# EAGLE design INSIDER (EAGLE 7.2.0)
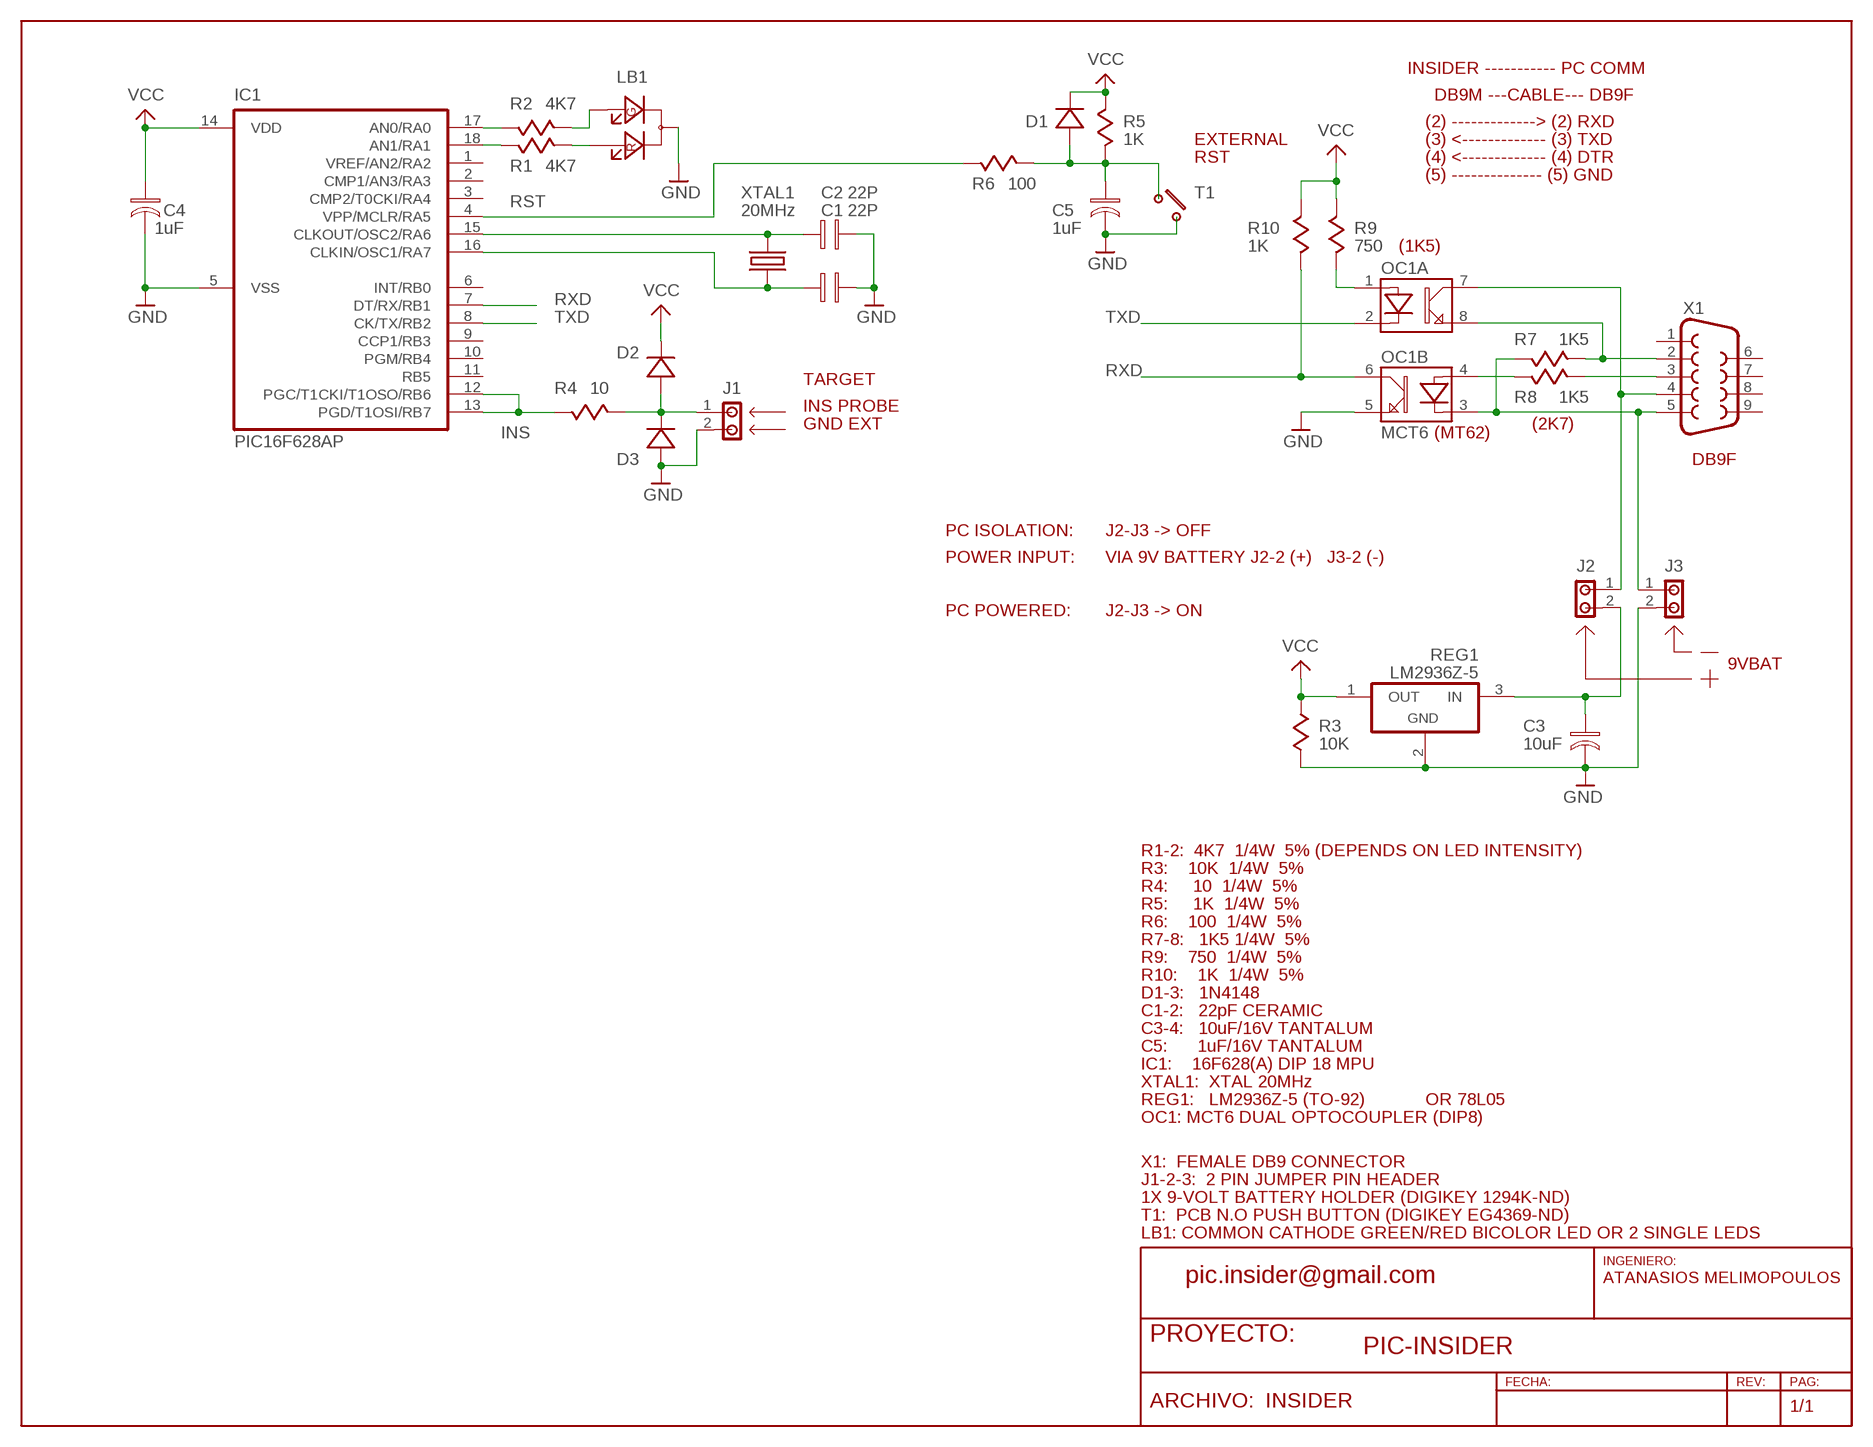
[diagram p0: schematic, sheet 1]

## Parts
C1  22P  CAP02  [C02]
C2  22P  CAP02  [C02]
C3  10uF  CAPE01  [CP01]
C4  1uF  CAPE01  [CP01]
C5  1uF  CAPE01  [CP01]
D1  1N4148  DIODE03  [D03]
D2  1N4148  DIODE03  [D03]
D3  1N4148  DIODE03  [D03]
IC1  PIC16F628AP  [DIL18]
J1  JMP2  [JP2]
J2  JMP2  [JP2]
J3  JMP2  [JP2]
LB1  LEDBIKC  [LEDBKC]
OC1  MCT6  OPTO2G  [DIL08]
R1  4K7  RES03  [R03]
R2  4K7  RES03  [R03]
R3  10K  RES03  [R03]
R4  10  RES03  [R03]
R5  1K  RES03  [R03]
R6  100  RES03  [R03]
R7  1K5  RES03  [R03]
R8  1K5  RES03  [R03]
R9  750  RES03  [R03]
R10  1K  RES03  [R03]
REG1  LM2936Z-5  78XXL  [TO92A]
T1  TEC3  [TEC3L]
X1  F09D  [F09D]
XTAL1  20MHz  XTALV300  [HC49V]

## Nets
GND: C1.P$2 C2.P$2 C3.P$2 C4.P$2 C5.P$2 D3.P$1(A) IC1.5(VSS) J1.2 J3.2 LB1.K OC1.5(B:E) R3.P$2 REG1.2(GND) T1.4
INS: IC1.12(PGC/T1CKI/T1OSO/RB6) IC1.13(PGD/T1OSI/RB7) R4.P$1
N$1: J3.1 OC1.3(B:K) R7.P$2 X1.5
N$2: OC1.8(A:E) R7.P$1 X1.2
N$3: J2.1 OC1.7(A:C) X1.4
N$4: R8.P$1 X1.3
N$5: OC1.4(B:A) R8.P$2
N$6: OC1.1(A:A) R9.P$1
N$9: D2.P$1(A) D3.P$2(K) J1.1 R4.P$2
N$10: C2.P$1 IC1.15(CLKOUT/OSC2/RA6) XTAL1.1
N$11: C1.P$1 IC1.16(CLKIN/OSC1/RA7) XTAL1.2
N$12: IC1.17(AN0/RA0) R2.P$2
N$13: LB1.R(A1) R1.P$1
N$14: LB1.G(A2) R2.P$1
N$16: IC1.18(AN1/RA1) R1.P$2
N$19: C5.P$1 D1.P$1(A) R5.P$2 R6.P$2 T1.1
N$20: C3.P$1 J2.2 REG1.3(IN)
RST: IC1.4(VPP/MCLR/RA5) R6.P$1
RXD: IC1.7(DT/RX/RB1) OC1.6(B:C) R10.P$1
TXD: IC1.8(CK/TX/RB2) OC1.2(A:K)
VCC: C4.P$1 D1.P$2(K) D2.P$2(K) IC1.14(VDD) R3.P$1 R5.P$1 R9.P$2 R10.P$2 REG1.1(OUT)
Unconnected: IC1.1(VREF/AN2/RA2) IC1.2(CMP1/AN3/RA3) IC1.3(CMP2/T0CKI/RA4) IC1.6(INT/RB0) IC1.9(CCP1/RB3) IC1.10(PGM/RB4) IC1.11(RB5) X1.1 X1.6 X1.7 X1.8 X1.9

## Notes on the sheet
- INSIDER ----------- PC COMM
- DB9M ---CABLE--- DB9F
- (2) -------------> (2) RXD
- EXTERNAL | (3) <------------- (3) TXD
- RST | (4) <------------- (4) DTR
- (5) -------------- (5) GND
- (1K5)
- TARGET
- INS PROBE
- GND EXT | (2K7)
- (MT62)
- DB9F
- PC ISOLATION: | J2-J3 -> OFF
- POWER INPUT: | VIA 9V BATTERY J2-2 (+)   J3-2 (-)
- PC POWERED: | J2-J3 -> ON
- 9VBAT
- R1-2:  4K7  1/4W  5% (DEPENDS ON LED INTENSITY)
- R3:    10K  1/4W  5%
- R4:     10  1/4W  5%
- R5:     1K  1/4W  5%
- R6:    100  1/4W  5%
- R7-8:   1K5 1/4W  5%
- R9:    750  1/4W  5%
- R10:    1K  1/4W  5%
- D1-3:   1N4148
- C1-2:   22pF CERAMIC
- C3-4:   10uF/16V TANTALUM
- C5:      1uF/16V TANTALUM
- IC1:    16F628(A) DIP 18 MPU
- XTAL1:  XTAL 20MHz
- REG1:   LM2936Z-5 (TO-92) | OR 78L05
- OC1: MCT6 DUAL OPTOCOUPLER (DIP8)
- X1:  FEMALE DB9 CONNECTOR
- J1-2-3:  2 PIN JUMPER PIN HEADER
- 1X 9-VOLT BATTERY HOLDER (DIGIKEY 1294K-ND)
- T1:  PCB N.O PUSH BUTTON (DIGIKEY EG4369-ND)
- LB1: COMMON CATHODE GREEN/RED BICOLOR LED OR 2 SINGLE LEDS
- pic.insider@gmail.com | ATANASIOS MELIMOPOULOS
- PIC-INSIDER

## Library data of the parts
C1 C2 = AtaLib:CAP: Capacitor
C3-C5 = AtaLib:CAPE: Capacitor Pol. Elect.
D1-D3 = AtaLib:DIODE: DIODES
IC1 = AtaLib:PIC16F6*: PIC 16F627 - 628 - 648 family
J1-J3 = AtaLib:JMP2: Jumper 2xPin
LB1 = AtaLib:LEDBIKC: LED BIcolor KC 5mm
OC1 = AtaLib:OPTO2G: OPTOCOUPLER dual unit
R1-R10 = AtaLib:RES: Resistor
REG1 = AtaLib:78XX: Positive Voltage Regulator
T1 = AtaLib:TEC: TECLAS INDIVIDUALES
X1 = AtaLib:F09: D-SUB 9 FEMALE
XTAL1 = AtaLib:XTALV300: Xtal Vert 300 mils

## Board
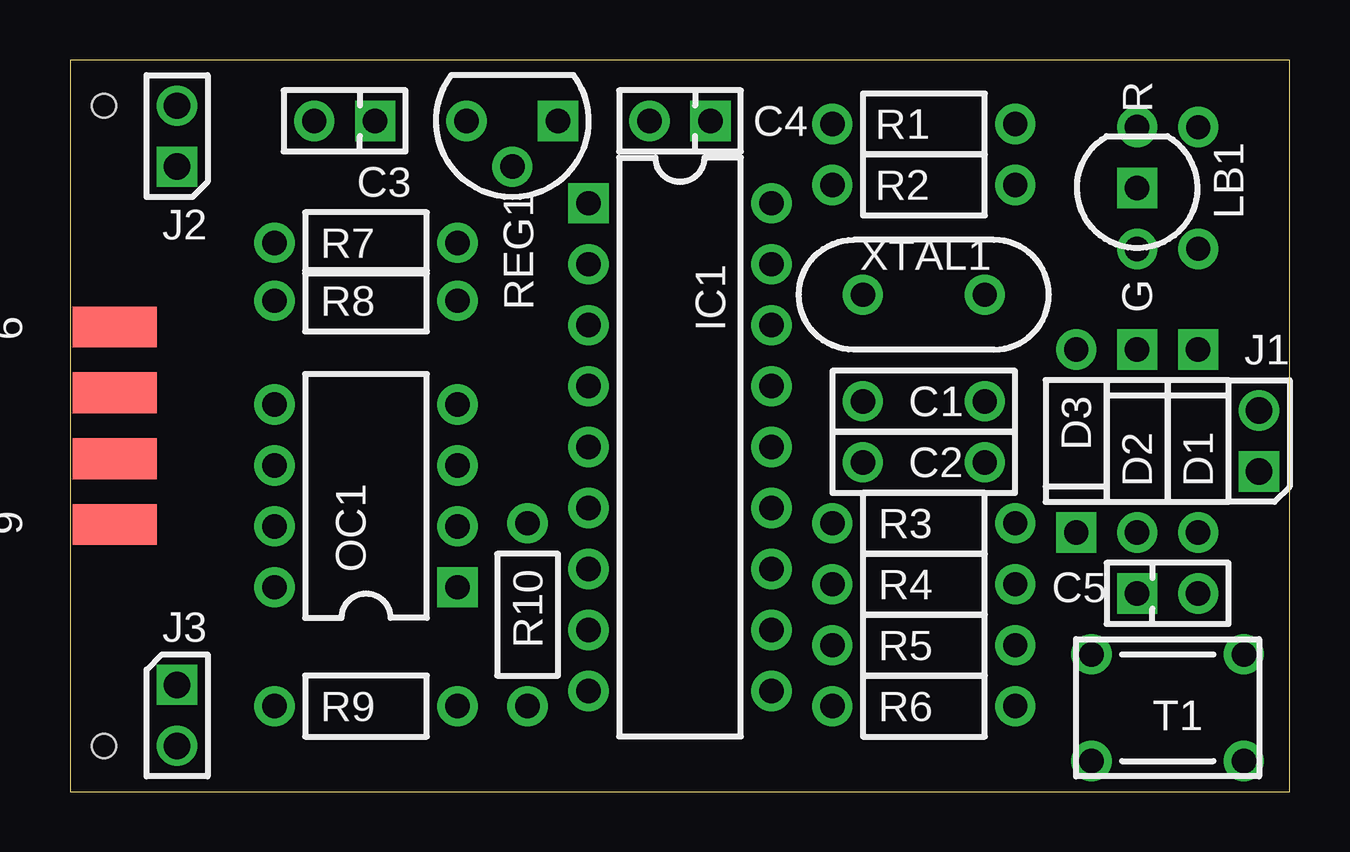
[diagram p1: board, top side]
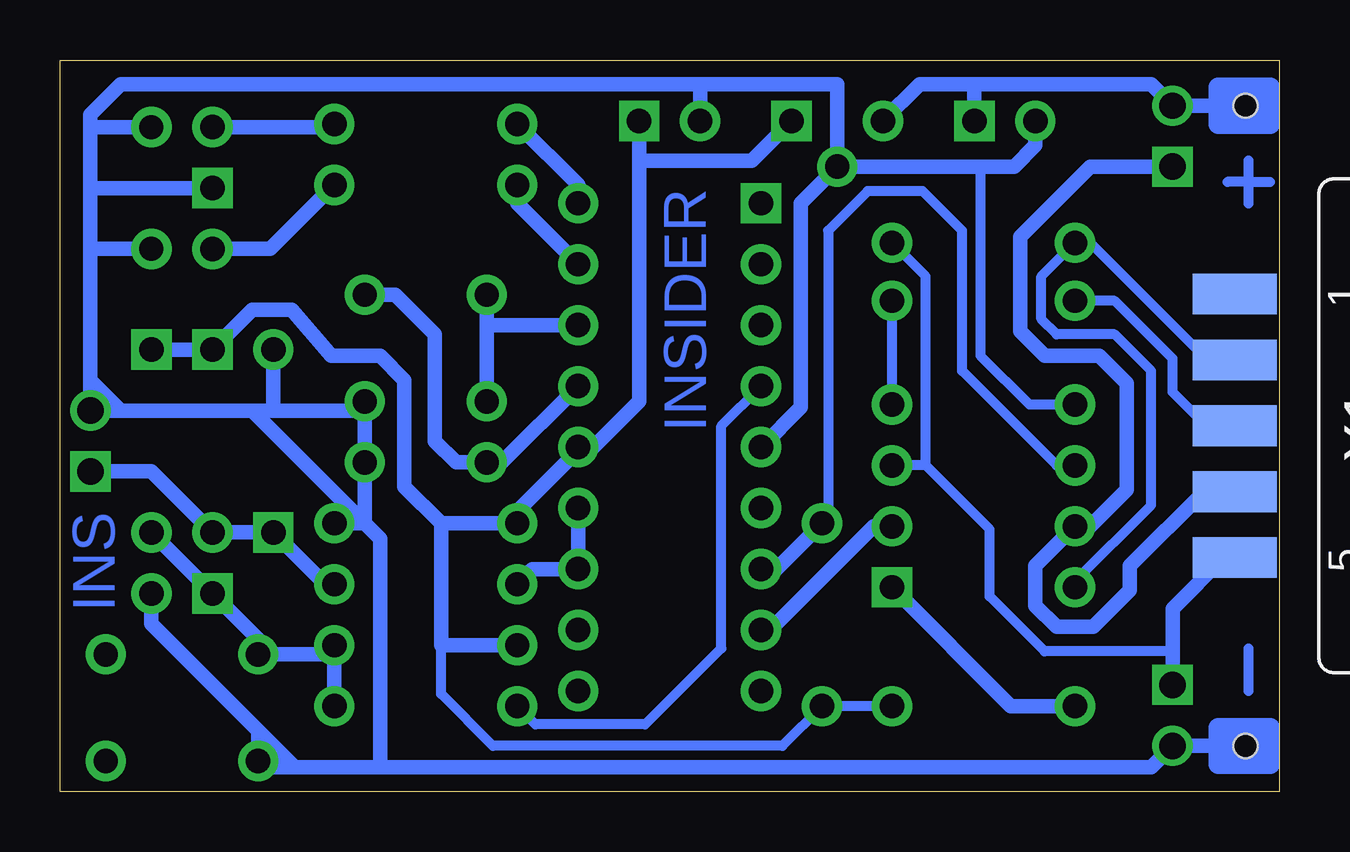
[diagram p2: board, bottom side, seen from below]

Size 50.8 x 30.48 mm. Coordinates in mm from the lower left corner, seen from the top.
Outline: 0,0 50.8,0 50.8,30.48 0,30.48 0,0
Copper layers (1*16): Top 0.035mm / dielectric 1.5mm / Bottom 0.035mm
Design rules "default": minimum track width 10mil, minimum drill 24mil, track to track 10mil, track to pad 10mil, pad to pad 10mil, via to via 10mil, smd to smd 8mil, copper to edge 25mil, drill to drill 10mil, minimum pad ring 10mil, minimum via ring 8mil, stop-mask expansion 8mil, vias tented up to drill 28mil, thermal gap 10mil
Holes 1 mm at 1.4,28.57 1.4,1.91

### Footprints (pad centres in the part's own frame; a part is rotated, then mirrored left to right if it is on the bottom)
C02 = drill 1.016 pad 1.676: P$1 -2.54,0; P$2 2.54,0
CP01 = drill 1.016 pad 1.676 square: P$1 -1.27,0 | drill 1.016 pad 1.676: P$2 1.27,0
D03 = drill 1.016 pad 1.676: P$1 -3.81,0 | drill 1.016 pad 1.676 square: P$2 3.81,0
DIL18 = drill 1.016 pad 1.676 square: 1 -10.16,-3.81 | drill 1.016 pad 1.676: 2 -7.62,-3.81; 3 -5.08,-3.81; 4 -2.54,-3.81; 5 0,-3.81; 6 2.54,-3.81; 7 5.08,-3.81; 8 7.62,-3.81; 9 10.16,-3.81; 10 10.16,3.81; 11 7.62,3.81; 12 5.08,3.81; 13 2.54,3.81; 14 0,3.81; 15 -2.54,3.81; 16 -5.08,3.81; 17 -7.62,3.81; 18 -10.16,3.81
JP2 = drill 1.1 pad 1.676 square: 1 0,1.27 | drill 1.1 pad 1.676: 2 0,-1.27
LEDBKC = drill 1.016 pad 1.676: G 2.54,0; R -2.54,0 | drill 1.016 pad 1.676 square: K 0,0
DIL08 = drill 1.016 pad 1.676 square: 1 -3.81,-3.81 | drill 1.016 pad 1.676: 2 -1.27,-3.81; 3 1.27,-3.81; 4 3.81,-3.81; 5 3.81,3.81; 6 1.27,3.81; 7 -1.27,3.81; 8 -3.81,3.81
R03 = drill 1.016 pad 1.676: P$1 -3.81,0; P$2 3.81,0
TO92A = drill 1.016 pad 1.676 square: 1 -1.27,0 | drill 1.016 pad 1.676: 2 0.635,1.905; 3 2.54,0
TEC3L = drill 1.016 pad 1.676: 1 -2.54,2.54; 2 3.81,2.54; 3 3.81,-1.905; 4 -2.54,-1.905
F09D = smd 1.7 x 3.5: 1 -5.486,-6.045; 2 -2.743,-6.045; 3 0,-6.045; 4 2.743,-6.045; 5 5.486,-6.045 | smd 1.7 x 3.5 bottom: 6 -4.115,-6.045; 7 -1.372,-6.045; 8 1.372,-6.045; 9 4.115,-6.045
HC49V = drill 1.016 pad 1.676: 1 -2.54,0; 2 2.54,0

### Placement (x,y rotation side)
C1  35.56,16.26 0 top
C2  35.56,13.72 0 top
C3  11.43,27.94 180 top
C4  25.4,27.94 180 top
C5  45.72,8.26 0 top
D1  46.99,14.61 90 top
D2  44.45,14.61 90 top
D3  41.91,14.61 270 top
IC1  25.4,14.35 270 top
J1  49.53,14.61 180 top
J2  4.45,27.3 180 top
J3  4.45,3.17 0 top
LB1  44.45,25.15 270 top
OC1  12.32,12.32 90 top
R1  35.56,27.81 180 top
R2  35.56,25.27 180 top
R3  35.56,11.18 0 top
R4  35.56,8.64 0 top
R5  35.56,6.1 0 top
R6  35.56,3.56 0 top
R7  12.32,22.86 0 top
R8  12.32,20.45 0 top
R9  12.32,3.56 0 top
R10  19.05,7.37 270 top
REG1  19.05,27.94 180 top
T1  45.09,3.17 0 top
X1  -4.19,15.24 270 bottom
XTAL1  35.56,20.7 180 top

### Tracks (layer width: path | path; a pad name or v marks a point on that pad's centre or on a via)
GND  (via drill 1 pad 1.68)
  Bottom 0.406: OC1.5 10.41,16.13 12.45,18.16 12.45,26.04
  Bottom 0.61: 48.26,15.88 J1.2 49.53,17.14 | 42.8,15.88 41.91,15.88 | 42.8,15.88 48.26,15.88 | 41.91,15.88 D3.P$1 | 48.26,15.88 49.53,17.14 | 24.13,29.46 C4.P$2 | 41.91,15.88 38.1,15.88 | 38.1,15.88 C2.P$2 38.1,11.18 | 38.1,15.88 C1.P$2 | 38.1,11.18 37.47,10.54 37.47,1.02 | 38.1,11.18 R3.P$2 | 2.54,1.91 J3.2 5.33,1.02 37.47,1.02 | REG1.2 12.45,26.04 11.05,26.04 10.16,26.92 C3.P$2 | REG1.2 18.41,29.46 24.13,29.46 | IC1.5 19.94,16 19.94,24.51 REG1.2 | 38.1,11.18 42.8,15.88 | C5.P$2 46.99,6.99 42.55,2.54 | 42.55,2.54 T1.4 42.55,1.02 41.02,1.02 | 37.47,1.02 41.02,1.02 | 41.02,1.02 42.55,2.54 | 24.13,29.46 48.26,29.46 49.53,28.19 49.53,27.69 | 49.53,17.14 49.53,22.61 | 49.53,22.61 49.53,25.15 | 49.53,25.15 49.53,27.69 | 49.53,22.61 v46.99,22.61 | 49.53,25.15 LB1.K | 49.53,27.69 v46.99,27.69
  Bottom 0.813: 0.38,1.91 0.38,1.14 2.54,1.14 2.54,1.91 | 0.38,1.91 0.38,2.67 2.54,2.67 2.54,1.91 | 0.38,1.91 2.54,1.91
INS
  Bottom 0.61: IC1.13 IC1.12 31.11,9.27 R4.P$1
N$1
  Bottom 0.406: R7.P$2 14.73,21.46 14.73,13.59 | 4.45,5.84 9.78,5.84 12.06,8.13 12.06,10.92 14.73,13.59 | 14.73,13.59 OC1.3
  Bottom 0.61: J3.1 4.45,5.84 4.45,7.62 2.31,9.75 X1.5
N$2
  Bottom 0.406: X1.2 3,17.98 7.87,22.86 R7.P$1 9.91,21.46 9.91,19.68 9.27,19.05 6.86,19.05 5.33,17.53 5.33,11.94 8.51,8.76 OC1.8
N$3
  Bottom 0.61: X1.4 3.12,12.5 6.22,9.4 6.22,8.38 7.75,6.86 9.27,6.86 10.16,7.75 10.16,9.4 OC1.7 7.87,11.05 6.35,12.57 6.35,17.02 7.49,18.16 9.78,18.16 10.79,19.18 10.79,23.11 7.87,26.04 J2.1
N$4
  Bottom 0.406: X1.3 3.05,15.24 4.45,16.64 4.45,18.03 6.86,20.45 R8.P$1
N$5
  Bottom 0.406: OC1.4 R8.P$2
N$6
  Bottom 0.61: R9.P$1 11.18,3.56 OC1.1
N$7
  Bottom 0.406: 1.27,25.4 1.27,26.29 | 1.27,25.4 0.38,25.4 | 1.27,25.4 2.16,25.4 | 1.27,24.51 1.27,25.4
N$8
  Bottom 0.406: 1.27,4.19 1.27,5.97
N$9
  Bottom 0.61: J1.1 46.99,13.34 D2.P$1 D3.P$2 39.75,8.64 R4.P$2
N$10
  Bottom 0.61: IC1.15 32.38,13.72 C2.P$1 34.29,13.72 35.18,14.61 35.18,19.05 36.83,20.7 XTAL1.1
N$11
  Bottom 0.61: 33.02,19.43 C1.P$1 | 33.02,19.43 XTAL1.2 | IC1.16 33.02,19.43
N$12
  Bottom 0.61: IC1.17 31.75,24.51 R2.P$2
N$13
  Bottom 0.61: R1.P$1 39.5,27.69 LB1.R
N$14
  Bottom 0.61: R2.P$1 42.04,22.61 LB1.G
N$16
  Bottom 0.61: IC1.18 29.21,25.27 R1.P$2
N$19
  Bottom 0.61: D1.P$1 C5.P$1 42.55,6.35 T1.1 39.37,5.71 | R6.P$2 39.37,5.71 | 39.37,5.71 R5.P$2
N$20
  Bottom 0.61: 2.54,28.57 J2.2 5.33,29.46 12.7,29.46 | 12.7,29.46 14.99,29.46 REG1.3 | 12.7,29.46 C3.P$1
  Bottom 0.813: 2.54,28.57 2.54,27.81 0.38,27.81 0.38,29.34 2.54,29.34 2.54,28.57 | 2.54,28.57 0.38,28.57
RST
  Bottom 0.406: IC1.4 23.24,15.24 23.24,5.97 26.42,2.79 30.99,2.79 R6.P$1
RXD
  Bottom 0.406: OC1.6 9.27,13.59 13.21,17.53 13.21,23.37 14.86,25.02 17.14,25.02 18.8,23.37 18.8,11.43 R10.P$1
  Bottom 0.61: R10.P$1 20.95,9.27 IC1.7
TXD
  Bottom 0.61: OC1.2 16.89,11.05 21.21,6.73 IC1.8
VCC
  Bottom 0.406: R9.P$2 R10.P$2 20.7,1.91 32.77,1.91 34.92,4.06 34.92,6.1
  Bottom 0.61: D1.P$2 D2.P$2 42.8,20.07 41.15,20.07 39.5,18.16 37.47,18.16 36.45,17.14 36.45,12.7 34.92,11.18 | 26.67,26.29 26.67,16.26 28.57,14.35 IC1.14 29.21,14.22 31.75,11.68 R3.P$1 34.92,11.18 | 26.67,26.29 C4.P$1 | REG1.1 21.97,26.29 26.67,26.29 | 34.92,11.18 34.92,6.1 R5.P$1

### Text on the board
Bottom: INSIDER | INS